# Altium schematic sheet Accelerometer.SchDoc
size A; SheetNumber: 2; SheetTotal: 5; SPICEModelCacheEDZXGBKT: <root> / <DocumentId>EDZXGBKT</DocumentId> / <CacheFrame Number="0"> / <Model Name="cap" Kind="MDL"> / <Text>*Default semiconductor capacitor / .MODEL CAP C()</Text> / </Model> / </CacheFrame> / </root>
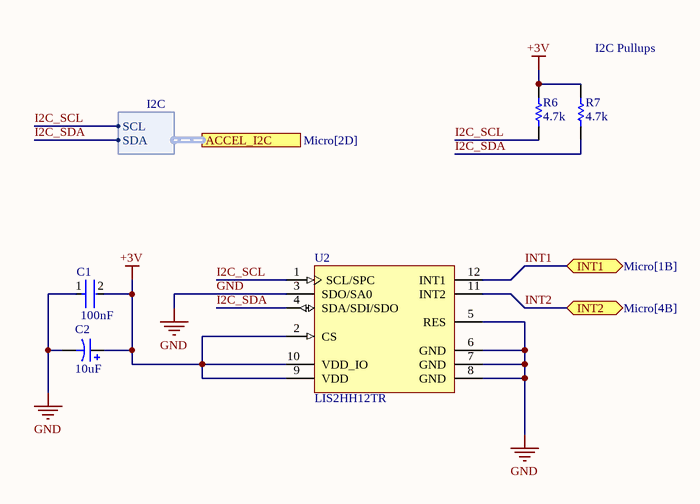
[diagram p0: Accelerometer.SchDoc]

## Parts
C1  100nF  [FP-C0402-BB-MFG]
C2  10uF  [C0805]
R6  4.7k  [RESC1608X55X30NL15T15]
R7  4.7k  [RESC1608X55X30NL15T15]
U2  LIS2HH12TR  [STM-LGA-12]

## Ports
ACCEL_I2C (harness I2C, see Micro[2D]), INT1 (bidir, see Micro[1B]), INT2 (bidir, see Micro[4B])

## Harnesses
I2C: SCL, SDA

## Nets
+3V: C1.2 C2.1 R6.2 R7.2 U2.2(CS) U2.9(VDD) U2.10(VDD_IO)
GND: C1.1 C2.2 U2.3(SDO/SA0) U2.5(RES) U2.6(GND) U2.7(GND) U2.8(GND)
I2C_SCL: R6.1 U2.1(SCL/SPC)
I2C_SDA: R7.1 U2.4(SDA/SDI/SDO) ; port ACCEL_I2C.SDA
INT1: U2.12(INT1) ; port INT1
INT2: U2.11(INT2) ; port INT2

## Notes on the sheet
- I2C Pullups

## Library data of the parts
C1 = CMP-2008-02046-2: CAP CER 0.1UF 10V X5R 0402; Manufacturer: Kemet; Manufacturer Part Number: C0402C104K8PACTU; Material: Ceramic; Capacitance: 0.10 μF; Temperature Coefficient: 15%; Tolerance: 0.1; Value: 0.10 μF; Package: C0402-BB; Temperature: -55°C to +125°C; ComponentLink2Description: Datasheet; Temperature Characteristic: X5R; Device Class L1: Passive Components; Height: 0.55mm; Lead Free: Yes; ComponentLink2URL: https://content.kemet.com/datasheets/KEM_C1002_X7R_SMD.pdf; Device Class L2: Capacitors; Temperature Range Low: -55°C; Temperature Range High: +125°C; RoHS: TRUE; Octopart: https://octopart.com/c0402c104k8pactu-kemet-140039; Automotive: No; Mouser Description: Capacitor 100 nF 10 VDC 0402; Category: Cap; Voltage Rating: 10 V; Digikey Description: CAP CER 0.1UF 10V X5R 0402; Ipc Land Pattern Name: CAPC10050X50; Device Class L3: Ceramic Capacitors
C2 = Cap Pol3: Alum. Electrolytic Cap 10µF 50V; 5mm Surface Mount; Lifetime 2000h; +105°C; Manufacturer: Wurth Electronics; Manufacturer Part Number: 865080642006; Polarity: Polar; Ripple Current: 95mA; Impedance: 2.8R; Life (Hours): 2000Hour; Tolerance: 20%; Published: 8-Jun-2000; LatestRevisionDate: 29-May-2009; LatestRevisionNote: IPC-7351 Footprint Added.; PackageReference: C0805; Publisher: Altium Limited; PackageDescription: Chip Capacitor; RoHS: Yes; Category: Aluminum Electrolytic Capacitors; Stock 1: 1; Pricing 1: 25=0.20400 (USD); Mount: Surface Mount; Case/Package: Radial; Min Operating Temperature: -55°C; Max Operating Temperature: 105°C; Package Quantity: 1; Packaging: Cut Tape; Voltage Rating: 50V; Ripple Current (AC): 95mA; Voltage Rating (DC): 50V; Capacitance: 10uF; Diameter: 5mm; Height: 5.5mm; Height - Seated (Max): 0.217inch; REACH SVHC: Unknown; RoHS Compliant: Yes; ComponentLink1URL: http://www.farnell.com/datasheets/1880176.pdf?src-supplier=Farnell; ComponentLink1Description: http://www.farnell.com/datasheets/1880176.pdf?src-supplier=Farnell; ComponentLink2URL: http://www.farnell.com/datasheets/1880176.pdf?src-supplier=Element14; ComponentLink2Description: http://www.farnell.com/datasheets/1880176.pdf?src-supplier=Element14; ComponentLink3URL: http://www.farnell.com/datasheets/1880176.pdf?src-supplier=Newark; ComponentLink3Description: http://www.farnell.com/datasheets/1880176.pdf?src-supplier=Newark; ComponentLink4URL: http://katalog.we-online.de/pbs/datasheet/865080642006.pdf?src-supplier=Digi-Key; ComponentLink4Description: http://katalog.we-online.de/pbs/datasheet/865080642006.pdf?src-supplier=Digi-Key; ComponentLink5URL: https://katalog.we-online.de/pbs/datasheet/865080642006.pdf?src-supplier=Digi-Key; ComponentLink5Description: https://katalog.we-online.de/pbs/datasheet/865080642006.pdf?src-supplier=Digi-Key; Supplier 1: RSComponents; Supplier Part Number 1: 8391862P
R6 R7 = CMP-1012-00586-3: Precision Thick Film Chip Resistor, 4.7 KOhm, +/- 1%, -55 to 155 degC, 0603 (1608 Metric), RoHS, Tape and Reel; Resistance: 220 Ohm; Voltage Rating: 50 V; Elements: 4; Case\Package: 1205; Tolerance: 5%; Power Rating: 250 mW; PackageReference: 0603; Max Operating Temperature: 125 degC; REACH SVHC: No SVHC; Width: 0.063 inch; Length: 0.126 inch; Height: 0.024 inch; Mount: Surface Mount; Package Quantity: 1; DatasheetVersion: Apr-15; ComponentLink1Description: Manufacturer URL; Min Operating Temperature: -55 degC; Packaging: Tape and Reel; Radiation Hardening: No; ComponentLink2URL: http://industrial.panasonic.com/cdbs/www-data/pdf/RDA0000/AOA0000C86.pdf; Case Code (Metric): 3216; Pins: 8; Case Code (Imperial): 1206; Type (Resistor): Thick Film; RoHSCompliant: true; ComponentLink2Description: Datasheet; PackageDescription: 2-Pin Surface Mount Device, Body 1.6 x 0.85 mm; ComponentLink1URL: http://www.panasonic.com/; Supplier 1: Digi-Key; Supplier Part Number 1: P4.70KHCT-ND
U2 = CMP-2000-07462-1: MEMS Digital Output Motion Sensor: Ultra-Low-Power High-Performance 3-Axis "Pico" Accelerometer, 1.71 to 3.6 V, -40 to 85 degC, 12-Pin LGA, RoHS, Tape and Reel; Manufacturer: STMicroelectronics; Bandwidth: 400Hz; Package Description: 12-Pin Land Grid Array Package, Body 2 x 2 mm, Pitch 0.5 mm; Manufacturer URL: http://www.st.com/; Lead Free: LeadFree; Case\/Package: LGA; RoHSCompliant: true; Min Operating Temperature: -40degC; Mounting Technology: SurfaceMount; Packaging: TapeandReel; Max Operating Temperature: 85degC; Mount: SurfaceMount; Number of Pins: 12; Datasheet URL: http://www.st.com/content/ccc/resource/technical/document/datasheet/c9/16/f2/79/ca/31/47/89/DM00096789.pdf/files/DM00096789.pdf/jcr:content/translations/en.DM00096789.pdf; Contact Plating: Gold; Package Reference: LGA-12; Datasheet Version: Rev. 5, 12/2015